# Altium schematic sheet Sh_Coccinelle.SchDoc
size A4
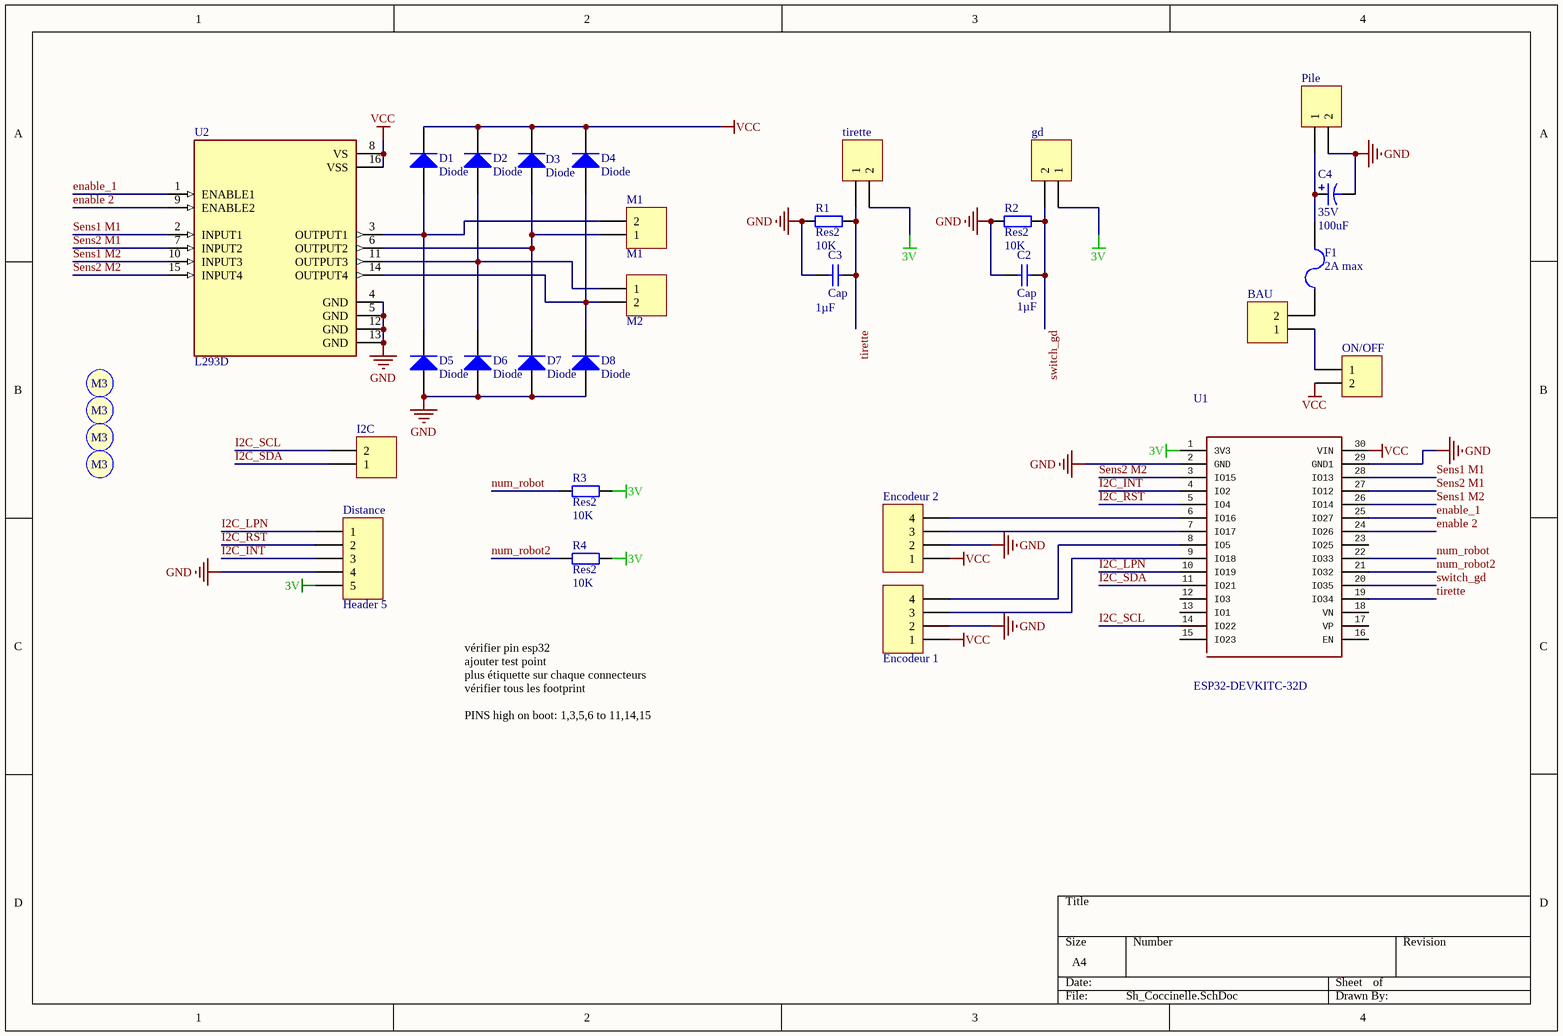
[diagram p0: Sh_Coccinelle.SchDoc]

## Parts
BAU  (no value)  [S2B-XH-A]
C2  Cap  value 1µF  [Capacitor 1206]
C3  Cap  value 1µF  [Capacitor 1206]
C4  35V  value 100uF  [Condensateur]
D1  Diode  [SMB]
D2  Diode  [SMB]
D3  Diode  [SMB]
D4  Diode  [SMB]
D5  Diode  [SMB]
D6  Diode  [SMB]
D7  Diode  [SMB]
D8  Diode  [SMB]
Distance  Header 5  [B5BXHAMLFSN]
Encodeur_1  (no value)  [B4BXHALFSN]
Encodeur_2  (no value)  [B4BXHALFSN]
F1  2A max  [PIN-W2/E2.8]
gd  (no value)  [S2B-XH-A]
I2C  (no value)  [S2B-XH-A]
M1  M1  [S2B-XH-A]
M2  M2  [S2B-XH-A]
ON/OFF  (no value)  [S2B-XH-A]
Pile  (no value)  [S2B-XH-A]
R1  Res2  value 10K  [Resistor 1206]
R2  Res2  value 10K  [Resistor 1206]
R3  Res2  value 10K  [Resistor 1206]
R4  Res2  value 10K  [Resistor 1206]
S1  Screw M3  [Screw M3]  (value not drawn)  (mechanical)
S2  Screw M3  [Screw M3]  (value not drawn)  (mechanical)
S3  Screw M3  [Screw M3]  (value not drawn)  (mechanical)
S4  Screw M3  [Screw M3]  (value not drawn)  (mechanical)
tirette  (no value)  [S2B-XH-A]
U1  ESP32-DEVKITC-32D  [MODULE_ESP32-DEVKITV1]
U2  L293D  [DIP880W50P254L2000H510Q16]

## Nets
3V: Distance.5 gd.1 R3.2 R4.2 tirette.2 U1.1(3V3)
GND: C2.1 C3.1 C4.2 D5.1(A) D6.1(A) D7.1(A) D8.1(A) Distance.4 Encodeur_1.2 Encodeur_2.2 Pile.2 R1.1 R2.1 U1.2(GND) U1.29(GND1) U2.4(GND) U2.5(GND) U2.12(GND) U2.13(GND)
VCC: D1.2(K) D2.2(K) D3.2(K) D4.2(K) Encodeur_1.1 Encodeur_2.1 ON/OFF.2 U1.30(VIN) U2.8(VS) U2.16(VSS)
enable 2: U1.24(IO26) U2.9(ENABLE2)
enable_1: U1.25(IO27) U2.1(ENABLE1)
I2C_INT: Distance.3 U1.4(IO2)
I2C_LPN: Distance.1 U1.10(IO19)
I2C_RST: Distance.2 U1.5(IO4)
I2C_SCL: I2C.2 U1.14(IO22)
I2C_SDA: I2C.1 U1.11(IO21)
num_robot: R3.1 U1.22(IO33)
num_robot2: R4.1 U1.21(IO32)
Sens1 M1: U1.28(IO13) U2.2(INPUT1)
Sens1 M2: U1.26(IO14) U2.10(INPUT3)
Sens2 M1: U1.27(IO12) U2.7(INPUT2)
Sens2 M2: U1.3(IO15) U2.15(INPUT4)
switch_gd: C2.2 gd.2 R2.2 U1.20(IO35)
tirette: C3.2 R1.2 tirette.1 U1.19(IO34)
NetBAU_1: BAU.1 ON/OFF.1
NetBAU_2: BAU.2 F1.1
NetC4_1: C4.1 F1.2 Pile.1
NetD1_1: D1.1(A) D5.2(K) M1.2 U2.3(OUTPUT1)
NetD2_1: D2.1(A) D6.2(K) M2.1 U2.11(OUTPUT3)
NetD3_1: D3.1(A) D7.2(K) M1.1 U2.6(OUTPUT2)
NetD4_1: D4.1(A) D8.2(K) M2.2 U2.14(OUTPUT4)
NetEncodeur_1_3: Encodeur_1.3 U1.9(IO18)
NetEncodeur_1_4: Encodeur_1.4 U1.8(IO5)
NetEncodeur_2_3: Encodeur_2.3 U1.7(IO17)
NetEncodeur_2_4: Encodeur_2.4 U1.6(IO16)

Not connected (* = marked no-connect by the designer): U1 12(IO3) 13(IO1) 15(IO23) 16(EN) 17(VP) 18(VN) 23(IO25)

## Notes on the sheet
- vérifier pin esp32
  ajouter test point
  plus étiquette sur chaque connecteurs
  vérifier tous les footprint
  PINS high on boot: 1,3,5,6 to 11,14,15
- (in symbol Screw M3) M3

## Library data of the parts
BAU gd I2C M1 M2 ON/OFF Pile tirette = Header 2H: Header, 2-Pin, Right Angle; LatestRevisionDate: 17-Jul-2002; LatestRevisionNote: Re-released for DXP Platform.; Publisher: Altium Limited
C2 C3 = Cap: Capacitor; Published: 8-Jun-2000; LatestRevisionDate: 17-Jul-2002; LatestRevisionNote: Re-released for DXP Platform.; PackageReference: RAD-0.3; Publisher: Altium Limited; PackageDescription: Radial Cap, Thru-Hole; 2 Leads; 0.3 in Pin Spacing
C4 = Cap Pol1: Polarized Capacitor (Radial); Published: 8-Jun-2000; LatestRevisionDate: 17-Jul-2002; LatestRevisionNote: Re-released for DXP Platform.; PackageReference: RB7.6-15; Publisher: Altium Limited; PackageDescription: Polarized Capacitor (Radial); 2 Leads
D1-D8 = Diode: Default Diode; Published: 8-Jun-2000; LatestRevisionDate: 17-Jul-2002; LatestRevisionNote: Re-released for DXP Platform.; PackageVersion: Sep-1996; PackageReference: SMC; Publisher: Altium Limited; PackageDescription: DO-214-AB/SMC; 2 C-Bend Leads; Body 7.9 x 5.9 mm, inc. leads (LxW); Code_JEDEC: DO-214-AB
Distance = Header 5: Header, 5-Pin; LatestRevisionDate: 17-Jul-2002; LatestRevisionNote: Re-released for DXP Platform.; Publisher: Altium Limited
Encodeur_1 Encodeur_2 = Header 4H: Header, 4-Pin, Right Angle; LatestRevisionDate: 17-Jul-2002; LatestRevisionNote: Re-released for DXP Platform.; Publisher: Altium Limited
F1 = Fuse 2: Fuse; Published: 8-Jun-2000; LatestRevisionDate: 17-Jul-2002; LatestRevisionNote: Re-released for DXP Platform.; PackageReference: PIN-W2/E2.8; Publisher: Altium Limited; PackageDescription: Thru-Hole; 2 Leads
R1-R4 = Res2: Resistor; Published: 8-Jun-2000; LatestRevisionDate: 17-Jul-2002; LatestRevisionNote: Re-released for DXP Platform.; PackageReference: AXIAL-0.4; Publisher: Altium Limited; PackageDescription: Axial Device, Thru-Hole; 2 Leads; 0.4 in Pin Spacing
U1 = ESP32-DEVKITC-32D: Eval Board For Esp-Wroom-32; MF: Espressif Systems; Availability: Unavailable; Package: None; SnapEDA_Link: https://www.snapeda.com/parts/ESP32-DEVKITC-32D/Espressif%20Systems/view-part/?ref=snap; MP: ESP32-DEVKITC-32D; Price: None; Value: *
U2 = L293D: Bipolar Motor Driver - Parallel 16-PowerDIP; MF: STMicroelectronics; MP: L293D; Package: DIP-16 STMicroelectronics; SnapEDA_Link: https://www.snapeda.com/parts/L293D/STMicroelectronics/view-part/?ref=snap; Purchase-URL: https://pricing.snapeda.com/search/part/L293D/?ref=eda; Check_prices: https://www.snapeda.com/parts/L293D/STMicroelectronics/view-part/?ref=eda; Availability: In Stock; Value: *; Price: None